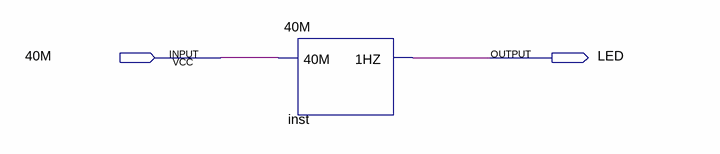
[diagram p0: schematic sheet]
// Quartus schematic 1.bdf as structural Verilog: 1 symbols, 2 pins
module \1  (
  input  \40M ,
  output LED
);

  \40M  inst (.\40M (\40M ), .\1HZ (LED));
endmodule
